# Altium schematic sheet Module.SchDoc
size A4
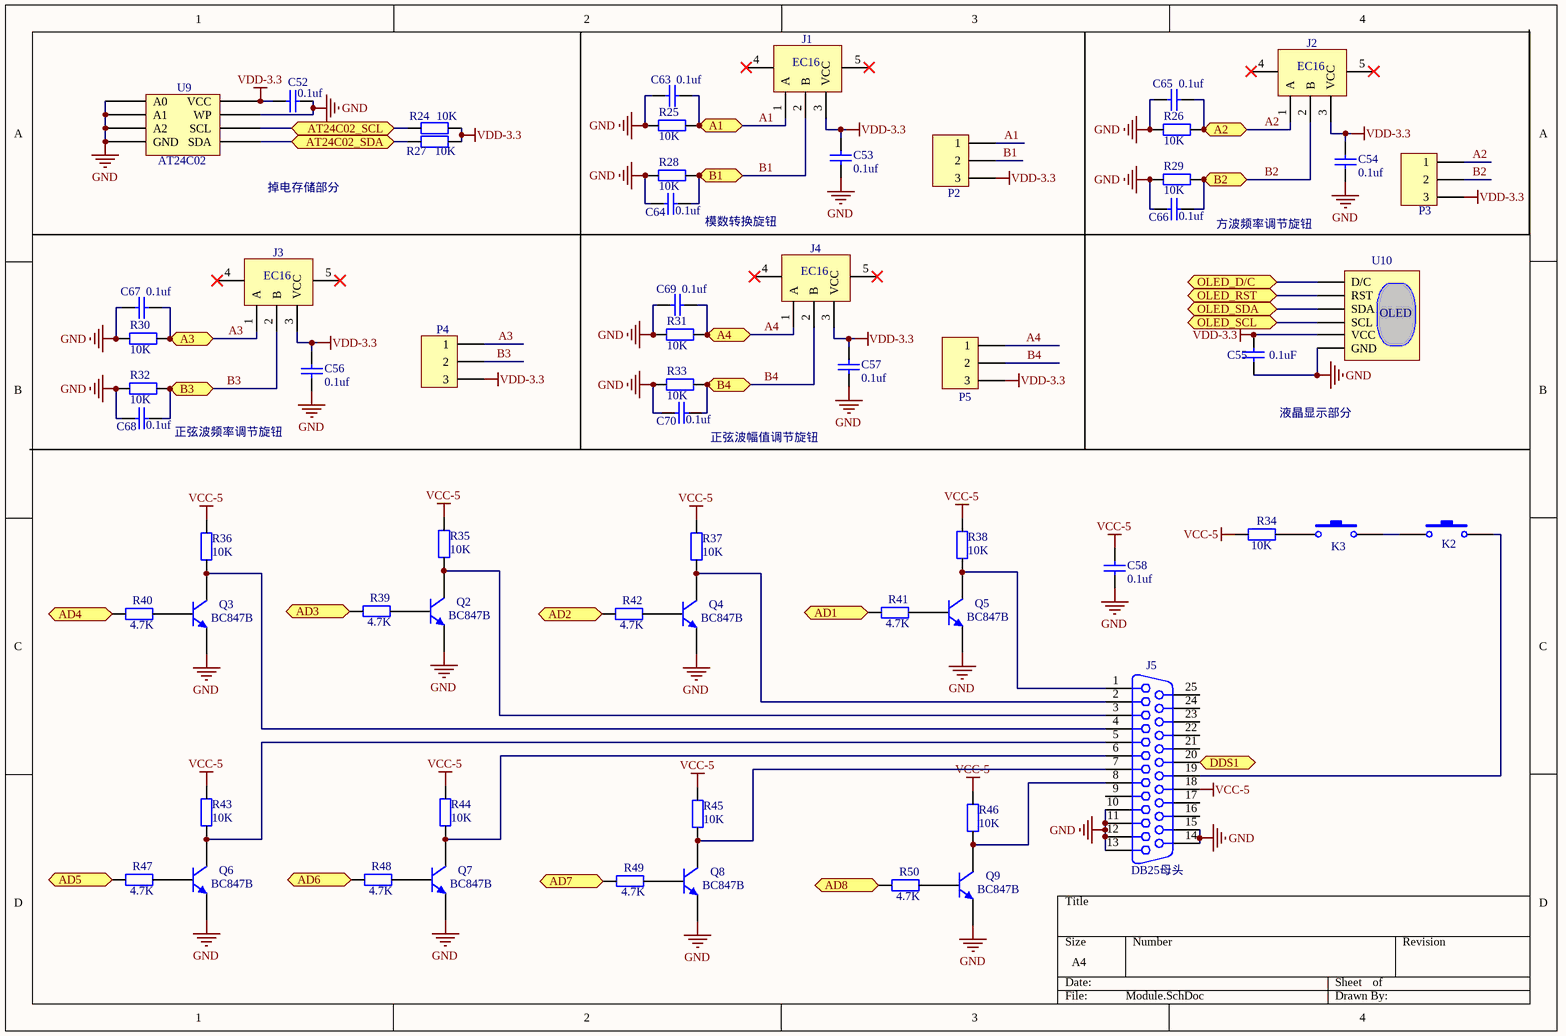
[diagram p0: Module.SchDoc]

## Parts
C52  value 0.1uf  [0603]  (hidden comment: Capacitor-0603)
C53  value 0.1uf  [0603]  (hidden comment: Capacitor-0603)
C54  value 0.1uf  [0603]  (hidden comment: Capacitor-0603)
C55  value 0.1uF  [0603]  (hidden comment: Capacitor-0805)
C56  value 0.1uf  [0603]  (hidden comment: Capacitor-0603)
C57  value 0.1uf  [0603]  (hidden comment: Capacitor-0603)
C58  value 0.1uf  [0603]  (hidden comment: Capacitor-0603)
C63  value 0.1uf  [0603]  (hidden comment: Capacitor-0603)
C64  value 0.1uf  [0603]  (hidden comment: Capacitor-0603)
C65  value 0.1uf  [0603]  (hidden comment: Capacitor-0603)
C66  value 0.1uf  [0603]  (hidden comment: Capacitor-0603)
C67  value 0.1uf  [0603]  (hidden comment: Capacitor-0603)
C68  value 0.1uf  [0603]  (hidden comment: Capacitor-0603)
C69  value 0.1uf  [0603]  (hidden comment: Capacitor-0603)
C70  value 0.1uf  [0603]  (hidden comment: Capacitor-0603)
J1  EC16编码器  [EC16]  (value not drawn)
J2  EC16编码器  [EC16]  (value not drawn)
J3  EC16编码器  [EC16]  (value not drawn)
J4  EC16编码器  [EC16]  (value not drawn)
J5  value DB25母头  [DB25母头]  (hidden comment: DB25)
K2  按键  [2MM接线端子]  (value not drawn)
K3  按键  [2MM接线端子]  (value not drawn)
P2  端子3  [3MM接线端子]  (value not drawn)
P3  端子3  [3MM接线端子]  (value not drawn)
P4  端子3  [3MM接线端子]  (value not drawn)
P5  端子3  [3MM接线端子]  (value not drawn)
Q2  BC847  [BC847B]  (value not drawn)
Q3  BC847  [BC847B]  (value not drawn)
Q4  BC847  [BC847B]  (value not drawn)
Q5  BC847  [BC847B]  (value not drawn)
Q6  BC847  [BC847B]  (value not drawn)
Q7  BC847  [BC847B]  (value not drawn)
Q8  BC847  [BC847B]  (value not drawn)
Q9  BC847  [BC847B]  (value not drawn)
R24  value 10K  [0603]  (hidden comment: Resistor-0603)
R25  value 10K  [0603]  (hidden comment: Resistor-0603)
R26  value 10K  [0603]  (hidden comment: Resistor-0603)
R27  value 10K  [0603]  (hidden comment: Resistor-0603)
R28  value 10K  [0603]  (hidden comment: Resistor-0603)
R29  value 10K  [0603]  (hidden comment: Resistor-0603)
R30  value 10K  [0603]  (hidden comment: Resistor-0603)
R31  value 10K  [0603]  (hidden comment: Resistor-0603)
R32  value 10K  [0603]  (hidden comment: Resistor-0603)
R33  value 10K  [0603]  (hidden comment: Resistor-0603)
R34  value 10K  [0603]  (hidden comment: Resistor-0603)
R35  value 10K  [0603]  (hidden comment: Resistor-0603)
R36  value 10K  [0603]  (hidden comment: Resistor-0603)
R37  value 10K  [0603]  (hidden comment: Resistor-0603)
R38  value 10K  [0603]  (hidden comment: Resistor-0603)
R39  value 4.7K  [0603]  (hidden comment: Resistor-0603)
R40  value 4.7K  [0603]  (hidden comment: Resistor-0603)
R41  value 4.7K  [0603]  (hidden comment: Resistor-0603)
R42  value 4.7K  [0603]  (hidden comment: Resistor-0603)
R43  value 10K  [0603]  (hidden comment: Resistor-0603)
R44  value 10K  [0603]  (hidden comment: Resistor-0603)
R45  value 10K  [0603]  (hidden comment: Resistor-0603)
R46  value 10K  [0603]  (hidden comment: Resistor-0603)
R47  value 4.7K  [0603]  (hidden comment: Resistor-0603)
R48  value 4.7K  [0603]  (hidden comment: Resistor-0603)
R49  value 4.7K  [0603]  (hidden comment: Resistor-0603)
R50  value 4.7K  [0603]  (hidden comment: Resistor-0603)
U9  AT24C02  [AT24C02]
U10  OLED  [OLED]

## Ports
A1, A2, A3, A4, AD1 (in), AD2 (in), AD3 (in), AD4 (in), AD5 (in), AD6 (in), AD7 (in), AD8 (in), AT24C02_SCL, AT24C02_SDA, B1, B2, B3, B4, DDS1 (in), OLED_D/C, OLED_RST, OLED_SCL, OLED_SDA

## Nets
GND: C52.1 C53.2 C54.2 C55.1 C56.2 C57.2 C58.2 C63.1 C64.1 C65.1 C66.1 C67.1 C68.1 C69.1 C70.1 J5.10 J5.11 J5.12 J5.13 J5.14 J5.15 Q2.1(E) Q3.1(E) Q4.1(E) Q5.1(E) Q6.1(E) Q7.1(E) Q8.1(E) Q9.1(E) R25.1 R26.1 R28.1 R29.1 R30.1 R31.1 R32.1 R33.1 U9.1(A0) U9.2(A1) U9.3(A2) U9.4(GND) U9.7(WP) U10.1(GND)
VCC-5: C58.1 J5.18 R34.1 R35.2 R36.2 R37.2 R38.2 R43.2 R44.2 R45.2 R46.2
VDD-3.3: C52.2 C53.1 C54.1 C55.2 C56.1 C57.1 J1.3(VCC) J2.3(VCC) J3.3(VCC) J4.3(VCC) P2.3 P3.3 P4.3 P5.3 R24.1 R27.1 U9.8(VCC) U10.2(VCC)
A1: C63.2 J1.1(A) P2.1 R25.2 ; port A1
A2: C65.2 J2.1(A) P3.1 R26.2 ; port A2
A3: C67.2 J3.1(A) P4.1 R30.2 ; port A3
A4: C69.2 J4.1(A) P5.1 R31.2 ; port A4
AD1: R41.2 ; port AD1
AD2: R42.2 ; port AD2
AD3: R39.2 ; port AD3
AD4: R40.2 ; port AD4
AD5: R47.2 ; port AD5
AD6: R48.2 ; port AD6
AD7: R49.2 ; port AD7
AD8: R50.2 ; port AD8
AT24C02_SCL: R24.2 U9.6(SCL) ; port AT24C02_SCL
AT24C02_SDA: R27.2 U9.5(SDA) ; port AT24C02_SDA
B1: C64.2 J1.2(B) P2.2 R28.2 ; port B1
B2: C66.2 J2.2(B) P3.2 R29.2 ; port B2
B3: C68.2 J3.2(B) P4.2 R32.2 ; port B3
B4: C70.2 J4.2(B) P5.2 R33.2 ; port B4
DDS1: J5.20 ; port DDS1
OLED_D/C: U10.6(D/C) ; port OLED_D/C
OLED_RST: U10.5(RST) ; port OLED_RST
OLED_SCL: U10.3(SCL) ; port OLED_SCL
OLED_SDA: U10.4(SDA) ; port OLED_SDA
NetJ5_1: J5.1 Q5.3(C) R38.1
NetJ5_2: J5.2 Q4.3(C) R37.1
NetJ5_3: J5.3 Q2.3(C) R35.1
NetJ5_4: J5.4 Q3.3(C) R36.1
NetJ5_5: J5.5 Q6.3(C) R43.1
NetJ5_6: J5.6 Q7.3(C) R44.1
NetJ5_7: J5.7 Q8.3(C) R45.1
NetJ5_8: J5.8 Q9.3(C) R46.1
NetJ5_19: J5.19 K2.2
NetK2_1: K2.1 K3.2
NetK3_1: K3.1 R34.2
NetQ2_2: Q2.2(B) R39.1
NetQ3_2: Q3.2(B) R40.1
NetQ4_2: Q4.2(B) R42.1
NetQ5_2: Q5.2(B) R41.1
NetQ6_2: Q6.2(B) R47.1
NetQ7_2: Q7.2(B) R48.1
NetQ8_2: Q8.2(B) R49.1
NetQ9_2: Q9.2(B) R50.1

Not connected (* = marked no-connect by the designer): J1 4* 5*; J2 4* 5*; J3 4* 5*; J4 4* 5*; J5 9 16 17 21 22 23 24 25

## Notes on the sheet
- 掉电存储部分
- 模数转换旋钮
- 方波频率调节旋钮
- 正弦波频率调节旋钮
- (near C70) 正弦波幅值调节旋钮
- 液晶显示部分

## Library data of the parts
C55 = Capacitor-0
U10 = O: Name: OLED
J1-J4 = EC16编码器: Name: EC16
Q2-Q9 = BC847: Name: BC847B
U9 = AT24C02: Name: AT24C02